# Altium schematic sheet PWR_N6V0.SchDoc: Fast Servo
size 297 x 209 mm; Organization: Altium Limited; Address1: L3, 12a Rodborough Rd; Address2: Frenchs Forest; Address3: NSW; Address4: Australia 2086; DocumentNumber: 21; SheetNumber: 21; SheetTotal: 28; Title2: Power -5.5 V
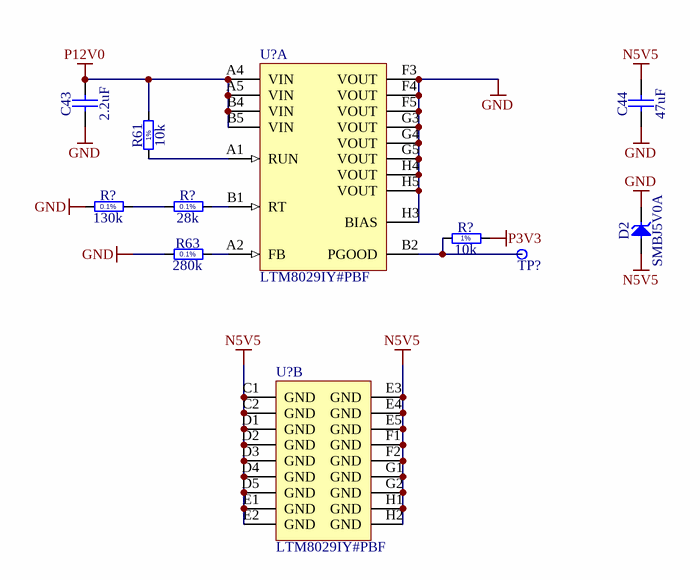
[diagram p0: PWR_N6V0.SchDoc]

## Parts
(Parts that share a designator on the sheet are numbered #1, #2 ... from top to bottom, then left to right.)
C43  2.2uF  [CAPC3216X180N]
C44  47uF  [CAPC3216X180N]
D2  SMBJ5V0A  [DIOM5336X265N]
R61  10k  [RESC1005X40N]
R63  280k  [RESC1608X55N]
R?#1  130k  [RESC1608X55N]
R?#2  28k  [RESC1608X55N]
R?#3  10k  [RESC1005X40N]
TP?  Test Point  [TPS127]  (value not drawn)
U?#1  LTM8029IY#PBF  [LT-BGA-35-11250X6250X3420]  (part A of 2)
U?#2  LTM8029IY#PBF  [LT-BGA-35-11250X6250X3420]  (part B of 2)

## Nets
GND: C43.1 C44.1 D2.1(C) R63.1 R?#1.1 U?#1.F3(VOUT) U?#1.F4(VOUT) U?#1.F5(VOUT) U?#1.G3(VOUT) U?#1.G4(VOUT) U?#1.G5(VOUT) U?#1.H3(BIAS) U?#1.H4(VOUT) U?#1.H5(VOUT)
N5V5: C44.2 D2.2(A) U?#2.C1(GND) U?#2.C2(GND) U?#2.D1(GND) U?#2.D2(GND) U?#2.D3(GND) U?#2.D4(GND) U?#2.D5(GND) U?#2.E1(GND) U?#2.E2(GND) U?#2.E3(GND) U?#2.E4(GND) U?#2.E5(GND) U?#2.F1(GND) U?#2.F2(GND) U?#2.G1(GND) U?#2.G2(GND) U?#2.H1(GND) U?#2.H2(GND)
P3V3: R?#3.2
P12V0: C43.2 R61.2 U?#1.A4(VIN) U?#1.A5(VIN) U?#1.B4(VIN) U?#1.B5(VIN)
NetR61_1: R61.1 U?#1.A1(RUN)
NetR63_2: R63.2 U?#1.A2(FB)
NetR?#1_2: R?#1.2 R?#2.1
NetR?#2_2: R?#2.2 U?#1.B1(RT)
NetR?#3_1: R?#3.1 TP?.1 U?#1.B2(PGOOD)

## Notes on the sheet
- Project
- Document
- Designer
- Drawn by
- Check.by
- File
- Last Mod.
- Print Date
- Sheet
- Size
- A4
- of
- Rev
- (in symbol R0402_10K_1%_0.0625W_100PPM) 1%
- (in symbol R0603_28K_0.1%_0.063W_10PPM) 0.1%
- (in symbol R0603_130K_0.1%_0.063W_10PPM) 0.1%
- (in symbol R0603_280K_0.1%_0.063W_10PPM) 0.1%

## Library data of the parts
C43 = CC1206_2.2UF_50V_10%_X7R: Non-polarised capacitor; Part Description: SMD Multilayer Chip Ceramic Capacitor; Manufacturer: GENERIC; Manufacturer1 Part Number: C1206C225K5RACTU; Voltage: 50V; TC: X7R; Tolerance: ±10%; Part Number: CC1206_2.2UF_50V_10%_X7R; Component Kind: Standard; Component Type: Standard; Pin Count: 2; Value: 2.2uF; Status: Preferred; Manufacturer Part Number: CC1206_2.2uF_50V_10%_X7R; Case: 1206; Mounted: Yes; Socket: No; SMD: Yes; Sense: No; Manufacturer1 Example: KEMET; Manufacturer1 ComponentHeight: 1.8mm; HelpURL: \\cern.ch\dfs\Applications\Altium\Datasheets\CC1206_X7R_KEMET.pdf; Author: CERN DEM MR; CreateDate: 06/06/2016; LatestRevisionDate: 06/06/2016
C44 = CC1206_47UF_10V_10%_X5R: Non-polarised capacitor; Part Description: SMD Multilayer Chip Ceramic Capacitor; Manufacturer: GENERIC; Manufacturer1 Part Number: GRM31CR61A476KE15; Voltage: 10V; TC: X5R; Tolerance: ±10%; Part Number: CC1206_47UF_10V_10%_X5R; Component Kind: Standard; Component Type: Standard; Pin Count: 2; Value: 47uF; Status: None; Manufacturer Part Number: CC1206_47UF_10V_10%_X5R; Case: 1206; Mounted: Yes; Socket: No; SMD: Yes; Sense: No; Manufacturer1 Example: MURATA; Manufacturer1 ComponentHeight: 1.8mm; HelpURL: \\cern.ch\dfs\Applications\Altium\Datasheets\CC1206_X5R_MURATA_GRM.pdf; Author: CERN DEM MR; CreateDate: 24/06/2016; LatestRevisionDate: 24/06/2016
D2 = SMBJ5V0A: Zener Diode; Part Description: Uni-Directional Transient Voltage Suppressor Diode; Manufacturer: FAIRCHILD SEMICONDUCTOR; Voltage: 5V; Power: 600W; PressFit: No; Bonding: No; Part Number: SMBJ5V0A; Component Kind: Standard; Component Type: Standard; Device: SMBJ5V0A; PackageDescription: DO-214-AA/SMB Diode, Molded Body; 5.34mm L X 3.625mm W X 2.65mm H, IPC Medium Density; Manufacturer Part Number: SMBJ5V0A; Pin Count: 2; Case: DO-214AA; Mounted: Yes; Socket: No; SMD: Yes; Sense: No; ComponentHeight: 2.65mm; HelpURL: \\cern.ch\dfs\Applications\Altium\Datasheets\SMBJ.pdf; Author: CERN DEM JLC; CreateDate: 08-Dec-08; LatestRevisionDate: 19-Dec-11
R61 R?#3 = R0402_10K_1%_0.0625W_100PPM: Resistor - 1%; Part Description: General Purpose Thick Film Chip Resistor; Manufacturer: GENERIC; Manufacturer1 Part Number: 232270671003L; PressFit: No; TC: ±100ppm/°C; Part Number: R0402_10K_1%_0.0625W_100PPM; Component Kind: Standard; Component Type: Standard; Pin Count: 2; Value: 10k; Status: Not Recommended; Manufacturer Part Number: R0402_10K_1%_0.0625W_100PPM; Case: 0402; Mounted: Yes; Sense: No; Socket: No; SMD: Yes; Manufacturer1 Example: YAGEO PHYCOMP; Manufacturer1 ComponentHeight: 0.4mm; HelpURL: \\cern.ch\dfs\Applications\Altium\Datasheets\R0402_Phycomp_RC0402.pdf; Author: CERN DEM JLC; CreateDate: 03-Dec-07; LatestRevisionDate: 17-Oct-12; Power: 0.0625W; Tolerance: ±1%
R63 = R0603_280K_0.1%_0.063W_10PPM: Resistor - 0.1%; Part Description: Thin Film Chip Resistor; Manufacturer: GENERIC; Manufacturer1 Part Number: RN73C1J280KBTDF; Power: 0.063W; TC: ±10ppm; PressFit: No; Part Number: R0603_280K_0.1%_0.063W_10PPM; Component Kind: Standard; Component Type: Standard; Pin Count: 2; Value: 280k; Status: Not Recommended; Tolerance: ±0.1%; Manufacturer Part Number: R0603_280K_0.1%_0.063W_10PPM; Case: 0603; Mounted: Yes; Sense: No; Socket: No; SMD: Yes; Manufacturer1 Example: TYCO HOLSWORTHY; Manufacturer1 ComponentHeight: 0.5mm; HelpURL: \\cern.ch\dfs\Applications\Altium\Datasheets\R0603_Tyco_RN73.pdf; Author: CERN DEM BC; CreateDate: 18/12/2019; LatestRevisionDate: 18/12/2019
R?#1 = R0603_130K_0.1%_0.063W_10PPM: Resistor - 0.1%; Part Description: Thin Film Chip Resistor; Manufacturer: GENERIC; Manufacturer1 Part Number: RN73C1J130KBTDF; Power: 0.063W; TC: ±10ppm; PressFit: No; Part Number: R0603_130K_0.1%_0.063W_10PPM; Component Kind: Standard; Component Type: Standard; Pin Count: 2; Value: 130k; Status: Not Recommended; Tolerance: ±0.1%; Manufacturer Part Number: R0603_130K_0.1%_0.063W_10PPM; Case: 0603; Mounted: Yes; Sense: No; Socket: No; SMD: Yes; Manufacturer1 Example: TYCO HOLSWORTHY; Manufacturer1 ComponentHeight: 0.5mm; HelpURL: \\cern.ch\dfs\Applications\Altium\Datasheets\R0603_Tyco_RN73.pdf; Author: CERN DEM JLC; CreateDate: 03/12/2007; LatestRevisionDate: 13/03/2008
R?#2 = R0603_28K_0.1%_0.063W_10PPM: Resistor - 0.1%; Part Description: Thin Film Chip Resistor; Manufacturer: GENERIC; Manufacturer1 Part Number: RN73C1J28KBTDF; Power: 0.063W; TC: ±10ppm; PressFit: No; Part Number: R0603_28K_0.1%_0.063W_10PPM; Component Kind: Standard; Component Type: Standard; Pin Count: 2; Value: 28k; Status: Not Recommended; Tolerance: ±0.1%; Manufacturer Part Number: R0603_28K_0.1%_0.063W_10PPM; Case: 0603; Mounted: Yes; Sense: No; Socket: No; SMD: Yes; Manufacturer1 Example: TYCO HOLSWORTHY; Manufacturer1 ComponentHeight: 0.5mm; HelpURL: \\cern.ch\dfs\Applications\Altium\Datasheets\R0603_Tyco_RN73.pdf; Author: CERN DEM JLC; CreateDate: 03/12/2007; LatestRevisionDate: 13/03/2008
TP? = SMD_PAD_1.27X1.27MM: Part Description: 1.27mm x 1.27mm PCB Copper Area (SMD Test Point); Mounted: No; Part Number: SMD_PAD_1.27X1.27MM; Component Kind: Standard (No BOM); Component Type: Standard (No BOM); Pin Count: 1; Family: Test Point; Socket: No; SMD: Yes; Sense: No; Status: None; ComponentHeight: 0mm; HelpURL: Undefined; Author: CERN DEM JLC; CreateDate: 12.01.2008; LatestRevisionDate: 12.01.2008; PackageDescription: 1.27mm x 1.27mm PCB Copper Area (SMD Test Point)
U?#1 U?#2 = CMP-0483-00029-1: 36 VIN, 600 mA Step-Down uModule Converter with 5 uA Quiescent Current, 35-pin BGA, -40 to 125 degC, Pb-Free, Tray; Manufacturer: Linear Technology; Extended Temp: E, I, MP; Isupply(mA): 0.005; Topology: Buck; Tracking: no; Switch Current(A): 1; Vin Min(V): 4.5; Vout Max(V): 18; Vin Max(V): 36; Frequency Adjust Range: 200kHz - 2.2MHz; Output Current(A): 0.6; Vout Min(V): 1.2; Frequency(kHz): 2200; Ishutdown(uA): 0.9; ComponentLink2URL: http://cds.linear.com/docs/en/datasheet/8029fa.pdf; ComponentLink3URL: http://cds.linear.com/docs/en/packaging/05081878_A_bga35.pdf; Mounting Technology: Surface Mount; ComponentLink1URL: http://www.linear.com/; RoHS: TRUE; ComponentLink1Description: Manufacturer URL; PackageVersion: Rev. A, 01/2013; Synchronous: no; PartNumber: LTM8029IY#PBF; PackageReference: BGA-35; DatasheetVersion: Rev. A; PackageDescription: 35-Ball BGA, Body 11.25 x 6.25 mm, Pitch 1.27 mm; Packing: Tray; ComponentLink2Description: Datasheet; ComponentLink3Description: Package Specification; Number of Outputs: 1; Code_JEDEC: MS-028